# EAGLE design schematic (EAGLE 8.2.0)
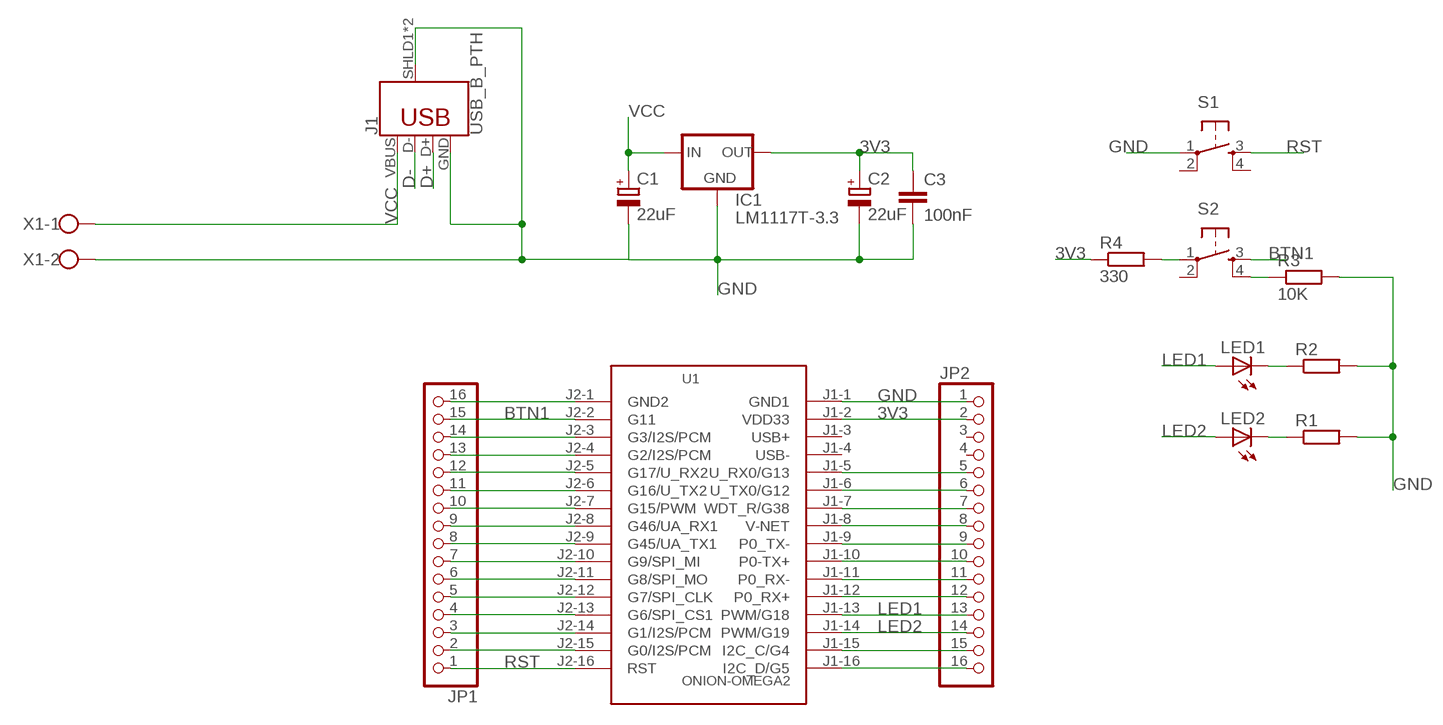
[diagram p0: schematic, sheet 1]

## Parts
C1  22uF  CPOL-EUE2.5-5  [E2,5-5]
C2  22uF  CPOL-EUE2.5-5  [E2,5-5]
C3  100nF  C-EU050-025X075  [C050-025X075]
IC1  LM1117T-3.3  [TO220]
J1  USB_B_PTH  [USB-B-PTH]
JP1  PINHD-1X16  [1X16]
JP2  PINHD-1X16  [1X16]
LED1  LED5MM  [LED5MM]
LED2  LED5MM  [LED5MM]
R1  R-EU_0204/7  [0204/7]
R2  R-EU_0204/7  [0204/7]
R3  10K  R-EU_0204/7  [0204/7]
R4  330  R-EU_0204/7  [0204/7]
S1  TAC_SWITCHPTH  [TACTILE-PTH]
S2  TAC_SWITCHPTH  [TACTILE-PTH]
U1  ONION-OMEGA2  [ONION-2MM-2X16]
X1  W237-102  [W237-102]

## Nets
3V3: C2.+ C3.1 IC1.2(OUT) JP2.2 R4.1 U1.J1-2(VDD33)
BTN1: JP1.15 S2.3 U1.J2-2(G11)
D+: J1.D+
D-: J1.D-
GND: C1.- C2.- C3.2 IC1.1(GND) J1.GND J1.SHLD1(SHIELD) J1.SHLD2(SHIELD) JP2.1 R1.2 R2.2 R3.2 S1.1 U1.J1-1(GND1) X1.2
LED1: JP2.13 LED1.A U1.J1-13(PWM/G18)
LED2: JP2.14 LED2.A U1.J1-14(PWM/G19)
N$1: JP1.16 U1.J2-1(GND2)
N$3: JP1.14 U1.J2-3(G3/I2S/PCM)
N$4: JP1.13 U1.J2-4(G2/I2S/PCM)
N$5: JP1.12 U1.J2-5(G17/U_RX2)
N$6: JP1.11 U1.J2-6(G16/U_TX2)
N$7: JP1.10 U1.J2-7(G15/PWM)
N$8: JP1.9 U1.J2-8(G46/UA_RX1)
N$9: JP1.8 U1.J2-9(G45/UA_TX1)
N$10: JP1.7 U1.J2-10(G9/SPI_MI)
N$11: JP1.6 U1.J2-11(G8/SPI_MO)
N$12: JP1.5 U1.J2-12(G7/SPI_CLK)
N$13: JP1.4 U1.J2-13(G6/SPI_CS1)
N$14: JP1.3 U1.J2-14(G1/I2S/PCM)
N$15: JP1.2 U1.J2-15(G0/I2S/PCM)
N$16: LED1.K(C) R2.1
N$17: LED2.K(C) R1.1
N$18: R3.1 S2.4
N$19: R4.2 S2.1
N$21: JP2.5 U1.J1-5(U_RX0/G13)
N$22: JP2.6 U1.J1-6(U_TX0/G12)
N$23: JP2.7 U1.J1-7(WDT_R/G38)
N$24: JP2.8 U1.J1-8(V-NET)
N$25: JP2.9 U1.J1-9(P0_TX-)
N$26: JP2.10 U1.J1-10(P0-TX+)
N$27: JP2.11 U1.J1-11(P0_RX-)
N$28: JP2.12 U1.J1-12(P0_RX+)
N$31: JP2.15 U1.J1-15(I2C_C/G4)
N$32: JP2.16 U1.J1-16(I2C_D/G5)
RST: JP1.1 S1.3 U1.J2-16(RST)
VCC: C1.+ IC1.3(IN) J1.VBUS X1.1
Unconnected: JP2.3 JP2.4 S1.2 S1.4 S2.2 U1.J1-3(USB+) U1.J1-4(USB-)

## Library data of the parts
C1 C2 = rcl:CPOL-EU: POLARIZED CAPACITOR, European symbol
C3 = rcl:C-EU: CAPACITOR, European symbol
IC1 = lm1117:LM1117T-*
J1 = SparkFun-Connectors:USB_B: USB Type B Connector SparkFun Products: SparkFun Stepoko <https://www.sparkfun.com/products/13899> PTH; PROD_ID: CONN-08278; SF_ID: PRT-00139
JP1 JP2 = pinhead:PINHD-1X16: PIN HEADER
LED1 LED2 = led:LED: LED OSRAM: - CHIPLED LG R971, LG N971, LY N971, LG Q971, LY Q971, LO R971, LY R971 LH N974, LH R974 LS Q976, LO Q976, LY Q976 LO Q996 - Hyper CHIPLED LW Q18S LB Q993, LB Q99A, LB R99A - SideLED LS A670, LO A670, LY A670, LG A670, LP A670 LB A673, LV A673, LT A673, LW A673 LH A674 LY A675 LS A676, LA A676, LO A676, LY A676, LW A676 LS A679, LY A679, LG A679 - Hyper Micro SIDELED® LS Y876, LA Y876, LO Y876, LY Y876 LT Y87S - SmartLED LW L88C, LW L88S LB L89C, LB L89S, LG L890 LS L89K, LO L89K, LY L89K LS L896, LA L896, LO L896, LY L896 - TOPLED LS T670, LO T670, LY T670, LG T670, LP T670 LSG T670, LSP T670, LSY T670, LOP T670, LYG T670 LG T671, LOG T671, LSG T671 LB T673, LV T673, LT T673, LW T673 LH T674 LS T676, LA T676, LO T676, LY T676, LB T676, LH T676, LSB T676, LW T676 LB T67C, LV T67C, LT T67C, LS T67K, LO T67K, LY T67K, LW E67C LS E67B, LA E67B, LO E67B, LY E67B, LB E67C, LV E67C, LT E67C LW T67C LS T679, LY T679, LG T679 LS T770, LO T770, LY T770, LG T770, LP T770 LB T773, LV T773, LT T773, LW T773 LH T774 LS E675, LA E675, LY E675, LS T675 LS T776, LA T776, LO T776, LY T776, LB T776 LHGB T686 LT T68C, LB T68C - Hyper Mini TOPLED® LB M676 - Mini TOPLED Santana® LG M470 LS M47K, LO M47K, LY M47K Source: http://www.osram.convergy.de LUXEON: - LUMILED® LXK2-PW12-R00, LXK2-PW12-S00, LXK2-PW14-U00, LXK2-PW14-V00 LXK2-PM12-R00, LXK2-PM12-S00, LXK2-PM14-U00 LXK2-PE12-Q00, LXK2-PE12-R00, LXK2-PE12-S00, LXK2-PE14-T00, LXK2-PE14-U00 LXK2-PB12-K00, LXK2-PB12-L00, LXK2-PB12-M00, LXK2-PB14-N00, LXK2-PB14-P00, LXK2-PB14-Q00 LXK2-PR12-L00, LXK2-PR12-M00, LXK2-PR14-Q00, LXK2-PR14-R00 LXK2-PD12-Q00, LXK2-PD12-R00, LXK2-PD12-S00 LXK2-PH12-R00, LXK2-PH12-S00 LXK2-PL12-P00, LXK2-PL12-Q00, LXK2-PL12-R00 Source: www.luxeon.com KINGBRIGHT: KA-3528ASYC Source: www.kingbright.com
R1-R4 = rcl:R-EU_: RESISTOR, European symbol
S1 S2 = SparkFun-Retired:TAC_SWITCH: Momentary Switch Button commonly used for reset or general input. Spark Fun Electronics SKU : COM-00097 SMT- SWCH-08247
U1 = omega:ONION-OMEGA2: Onion Omega
X1 = con-wago-500:W237-102: WAGO SCREW CLAMP; MPN: 237-102; OC_FARNELL: unknown; OC_NEWARK: 70K9898

## Net classes
0 default: width 0.762 mm, drill 1.016 mm, clearance 0.762 mm

## Board
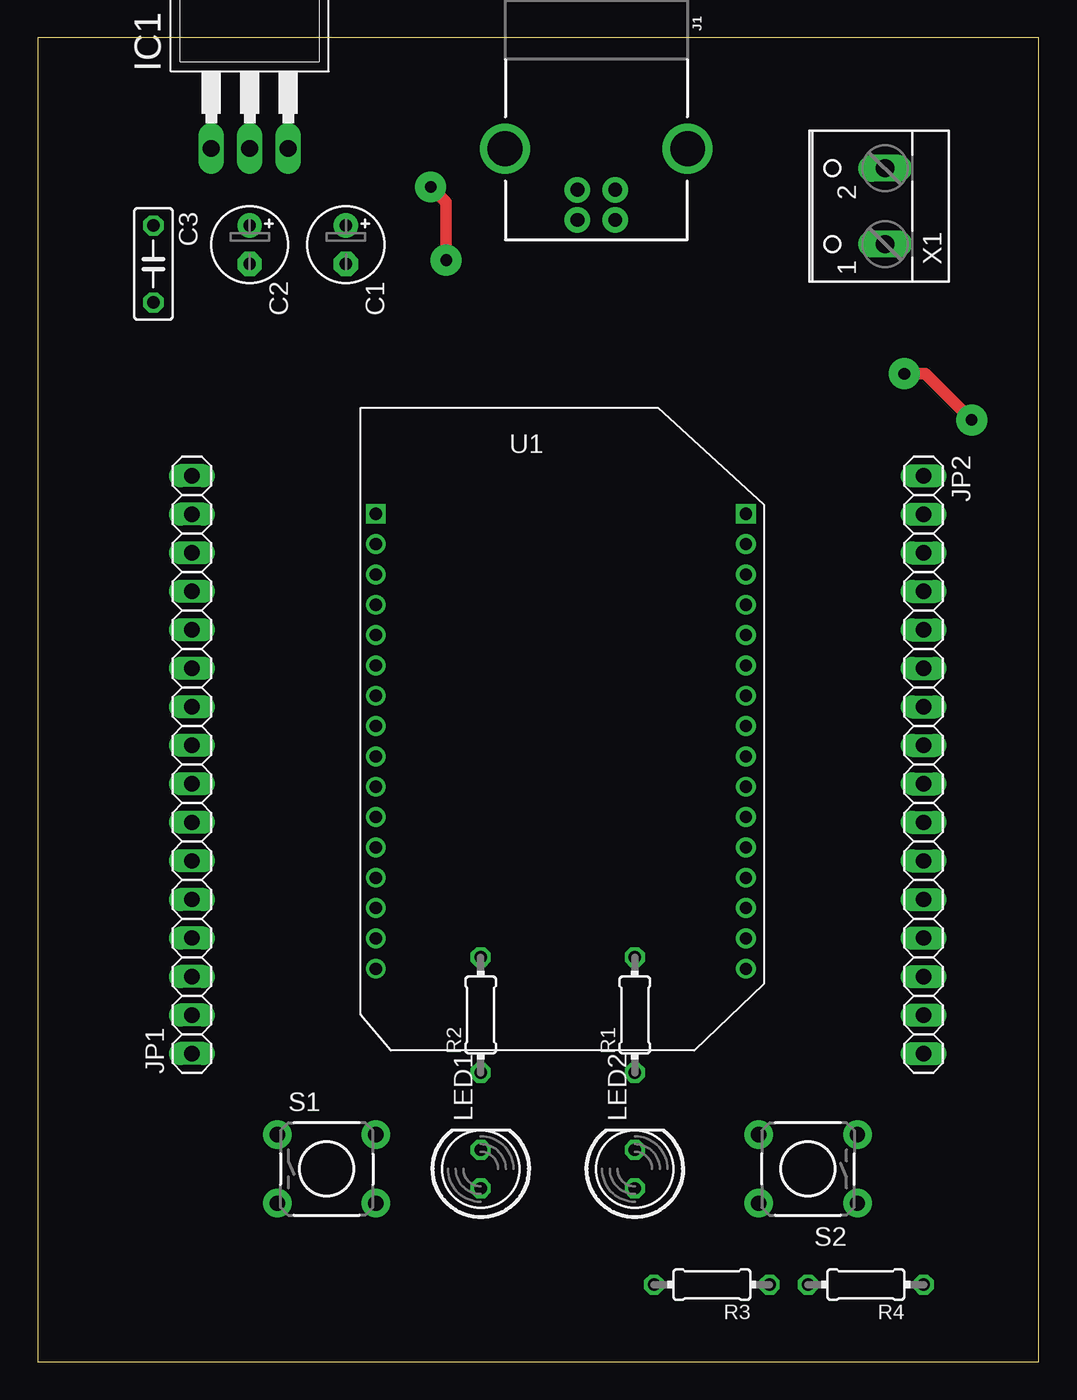
[diagram p1: board, top side]
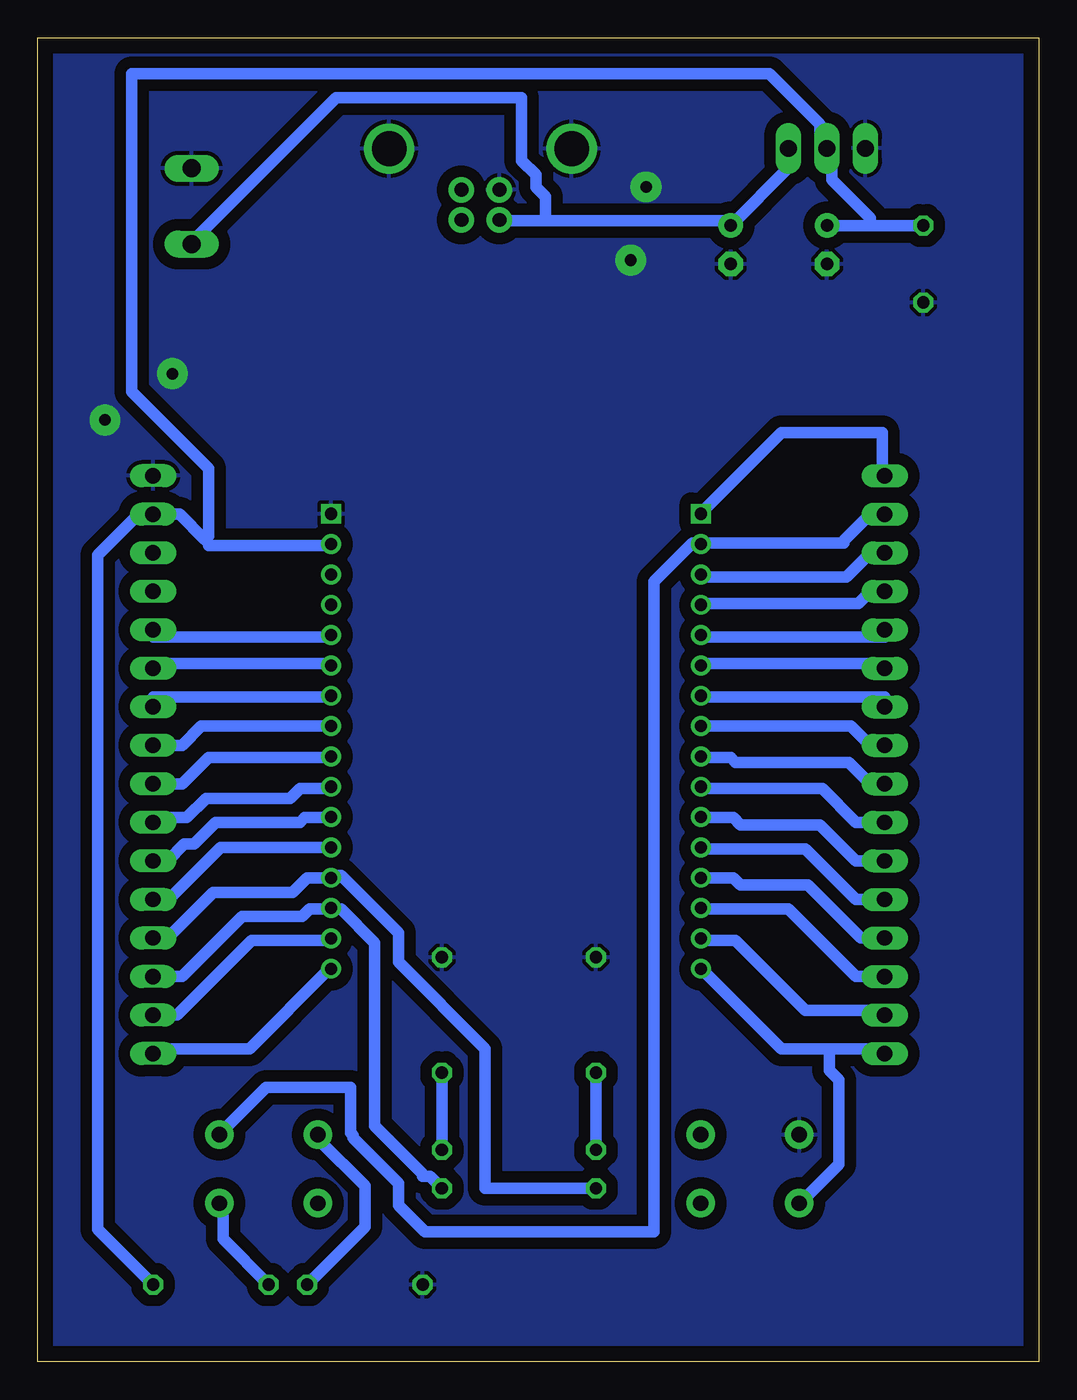
[diagram p2: board, bottom side, seen from below]

Size 66.02 x 87.3 mm. Coordinates in mm from the lower left corner, seen from the top.
Outline: 0,0 66.02,0 66.02,87.3 0,87.3 0,0
Copper layers (1*16): Top 0.035mm / dielectric 1.5mm / Bottom 0.035mm
Design rules "default": minimum track width 6mil, minimum drill 0.35mm, track to track 6mil, track to pad 6mil, pad to pad 6mil, via to via 6mil, smd to smd 6mil, copper to edge 40mil, drill to drill 6mil, minimum pad ring 10mil, minimum via ring 8mil, stop-mask expansion 4mil, vias tented up to drill 0mil, thermal gap 10mil

### Footprints (pad centres in the part's own frame; a part is rotated, then mirrored left to right if it is on the bottom)
E2,5-5 = drill 0.813 pad 1.6: + -1.27,0 | drill 0.813 pad 1.6 octagon: - 1.27,0
C050-025X075 = drill 0.813 octagon: 1 -2.54,0; 2 2.54,0
TO220 = drill 1.118 long: 1 -2.54,-6.35; 2 0,-6.35; 3 2.54,-6.35
USB-B-PTH = drill 0.914 pad 1.676: D+ 4,1.25; D- 5.981,1.25; GND 4,-1.25; VBUS 5.981,-1.25 | drill 2.286: SHLD1 1.282,-6.02; SHLD2 1.282,6.02
1X16 = drill 1.016 long: 1 -19.05,0; 2 -16.51,0; 3 -13.97,0; 4 -11.43,0; 5 -8.89,0; 6 -6.35,0; 7 -3.81,0; 8 -1.27,0; 9 1.27,0; 10 3.81,0; 11 6.35,0; 12 8.89,0; 13 11.43,0; 14 13.97,0; 15 16.51,0; 16 19.05,0
LED5MM = drill 0.813 octagon: A -1.27,0; K 1.27,0
0204/7 = drill 0.813 octagon: 1 -3.81,0; 2 3.81,0
TACTILE-PTH = drill 1.016 pad 1.88: 1 -3.251,2.261; 2 3.251,2.261; 3 -3.251,-2.261; 4 3.251,-2.261
ONION-2MM-2X16 = drill 0.8 square: J1-1 12.4,14; J2-1 -12,14 | drill 0.8: J1-2 12.4,12; J1-3 12.4,10; J1-4 12.4,8; J1-5 12.4,6; J1-6 12.4,4; J1-7 12.4,2; J1-8 12.4,0; J1-9 12.4,-2; J1-10 12.4,-4; J1-11 12.4,-6; J1-12 12.4,-8; J1-13 12.4,-10; J1-14 12.4,-12; J1-15 12.4,-14; J1-16 12.4,-16; J2-2 -12,12; J2-3 -12,10; J2-4 -12,8; J2-5 -12,6; J2-6 -12,4; J2-7 -12,2; J2-8 -12,0; J2-9 -12,-2; J2-10 -12,-4; J2-11 -12,-6; J2-12 -12,-8; J2-13 -12,-10; J2-14 -12,-12; J2-15 -12,-14; J2-16 -12,-16
W237-102 = drill 1.194 long: 1 -2.5,-1.27; 2 2.5,-1.27

### Placement (x,y rotation side)
C1  20.32,73.66 270 top
C2  13.97,73.66 270 top
C3  7.62,72.39 270 top
IC1  13.97,86.36 0 top
J1  36.83,81.28 270 top
JP1  10.16,39.37 90 top
JP2  58.42,39.37 270 top
LED1  29.21,12.7 90 top
LED2  39.37,12.7 90 top
R1  39.37,22.86 90 top
R2  29.21,22.86 90 top
R3  44.45,5.08 180 top
R4  54.61,5.08 180 top
S1  19.05,12.7 0 top
S2  50.8,12.7 180 top
U1  34.29,41.91 0 top
X1  54.61,76.2 90 top

### Tracks (layer width: path | path; a pad name or v marks a point on that pad's centre or on a via)
3V3
  Bottom 0.762: C2.+ 11.11,74.93 | 11.11,74.93 C3.1 | 11.11,74.93 11.11,75.41 13.65,77.95 13.65,79.69 IC1.2 14.13,80.33 14.45,80.64 14.45,81.6 17.78,84.93 59.85,84.93 59.85,63.98 54.77,58.9 54.77,54.45 55.01,54.21 | 55.01,54.21 56.67,55.88 JP2.2 58.74,55.72 59.53,55.72 62.07,53.18 62.07,8.73 R4.1 | 55.01,54.21 54.77,53.98 54.77,53.82 46.83,53.82 U1.J1-2
BTN1
  Bottom 0.762: JP1.15 11.11,55.88 12.86,54.13 12.86,53.98 22.22,53.98 U1.J2-2 22.54,53.98 22.86,53.98 25.4,51.44 25.4,8.57 40.48,8.57 42.23,10.32 42.23,11.75 45.24,14.76 45.24,14.92 45.4,15.08 45.4,18.1 50.96,18.1 53.98,15.08 S2.3
GND  (via drill 0.76 pad 2.03)
  Top 0.762: v57.15,65.15 58.55,65.15 v61.59,62.1 | v26.92,72.64 26.92,76.45 v25.91,77.47
  pour Bottom: -17.78,93.98 -17.78,-10.16 -15.24,-12.7 76.2,-12.7 76.2,96.52 78.74,99.06 -12.7,99.06
LED1
  Bottom 0.762: JP2.13 57.47,27.94 54.45,30.96 49.21,30.96 48.26,31.91 46.83,31.91 U1.J1-13 46.36,32.07 46.04,32.07 42.23,28.26 42.23,26.35 36.51,20.64 36.51,11.43 LED1.A
LED2
  Bottom 0.762: JP2.14 56.52,25.4 52.55,29.37 48.58,29.37 48.1,29.85 46.83,29.85 U1.J1-14 46.36,29.85 46.04,29.85 43.81,27.62 43.81,15.56 40.64,12.38 40.64,12.22 40.16,12.22 LED2.A
N$1
  Bottom 0.762: JP1.16 10.32,58.58 10.32,61.28 16.99,61.28 22.22,56.04 U1.J2-1
N$3
  Bottom 0.762: JP1.14 11.11,53.34 12.7,51.75 22.22,51.75 U1.J2-3
N$4
  Bottom 0.762: JP1.13 11.11,50.8 11.91,50.01 22.22,50.01 U1.J2-4
N$5
  Bottom 0.762: JP1.12 10.16,47.78 22.22,47.78 U1.J2-5
N$6
  Bottom 0.762: JP1.11 10.16,46.04 22.22,46.04 U1.J2-6
N$7
  Bottom 0.762: JP1.10 10.16,43.82 22.22,43.82 U1.J2-7
N$8
  Bottom 0.762: U1.J2-8 12.38,41.91 11.11,40.64 JP1.9
N$9
  Bottom 0.762: JP1.8 11.11,38.1 12.54,39.53 20,39.53 20.32,39.85 22.22,39.85 U1.J2-9
N$10
  Bottom 0.762: JP1.7 12.07,35.56 14.29,37.78 22.22,37.78 U1.J2-10
N$11
  Bottom 0.762: JP1.6 12.07,33.02 14.45,35.4 19.68,35.4 20.16,35.88 22.22,35.88 U1.J2-11
N$12
  Bottom 0.762: JP1.5 12.07,30.48 15.4,33.81 22.22,33.81 U1.J2-12
N$13
  Bottom 0.762: JP1.4 11.75,27.94 15.24,31.43 19.68,31.43 20.16,31.91 22.22,31.91 U1.J2-13
N$14
  Bottom 0.762: JP1.3 12.07,25.4 16.51,29.85 22.22,29.85 U1.J2-14
N$15
  Bottom 0.762: JP1.2 10.16,23.18 15.4,23.18 20,27.78 22.22,27.78 U1.J2-15
N$16
  Bottom 0.762: R2.1 LED1.K
N$17
  Bottom 0.762: R1.1 LED2.K
N$18
  Bottom 0.762: R3.1 44.45,8.89 44.45,11.59 47.47,14.61 47.47,14.92 S2.4
N$19
  Bottom 0.762: R4.2 53.82,8.1 53.82,10.16 53.98,10.32 S2.1
N$21
  Bottom 0.762: JP2.5 58.42,47.78 46.83,47.78 U1.J1-5
N$22
  Bottom 0.762: JP2.6 58.42,46.04 46.83,46.04 U1.J1-6
N$23
  Bottom 0.762: JP2.7 58.42,43.82 46.83,43.82 U1.J1-7
N$24
  Bottom 0.762: U1.J1-8 55.25,41.91 56.52,40.64 JP2.8
N$25
  Bottom 0.762: JP2.9 56.52,38.1 54.77,39.85 46.83,39.85 U1.J1-9
N$26
  Bottom 0.762: JP2.10 58.42,35.88 56.2,35.88 54.93,37.15 49.37,37.15 48.74,37.78 46.83,37.78 U1.J1-10
N$27
  Bottom 0.762: JP2.11 57.47,33.02 56.36,34.13 55.72,34.13 54.29,35.56 48.74,35.56 48.42,35.88 46.83,35.88 U1.J1-11
N$28
  Bottom 0.762: U1.J1-12 53.97,33.91 57.4,30.48 JP2.12
N$31
  Bottom 0.762: JP2.15 56.83,22.86 51.91,27.78 46.83,27.78 U1.J1-15
N$32
  Bottom 0.762: JP2.16 58.42,20.64 52.07,20.64 46.83,25.88 U1.J1-16
RST
  Bottom 0.762: 13.81,20.64 10.16,20.64 JP1.1 | 13.81,20.64 16.99,20.64 22.22,25.88 U1.J2-16 | 13.81,20.64 13.81,19.21 13.18,18.57 13.18,13.02 15.72,10.48 S1.3
VCC
  Bottom 0.762: IC1.3 16.51,78.74 C1.+ 20.48,75.25 32.54,75.25 | 32.54,75.25 35.56,75.25 J1.VBUS | 32.54,75.25 32.54,76.83 33.18,77.47 33.18,78.26 34.13,79.22 34.13,83.34 46.36,83.34 55.88,73.82 X1.1